# Altium project Module_Logic_MCU_ATtiny3224.PrjPcb
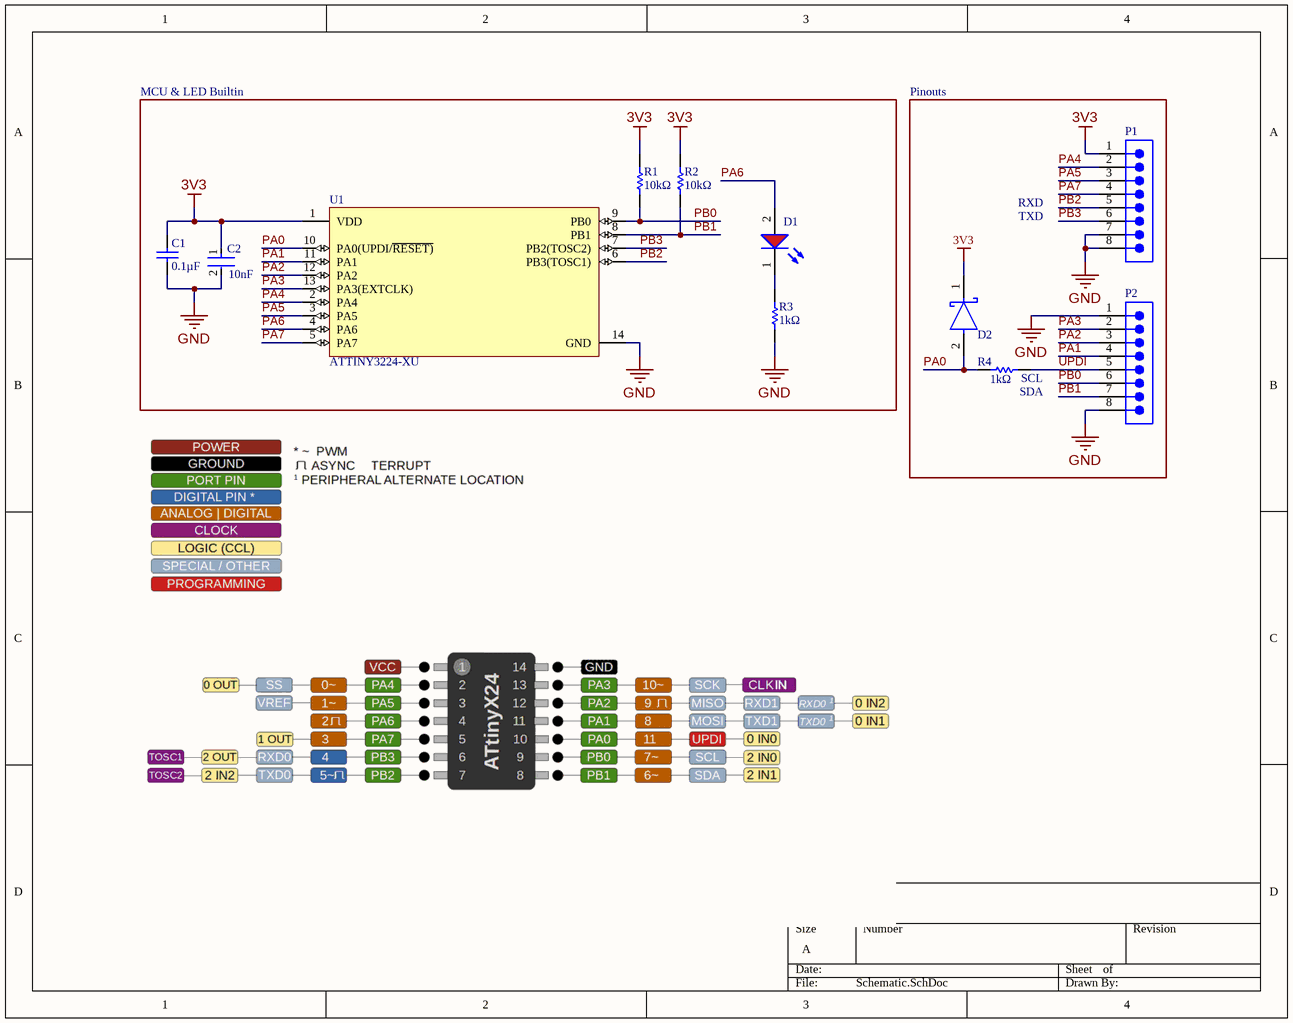
[diagram p0: Schematic.SchDoc]
1 sheet, 11 parts. Net scope: global (net labels, ports and power ports of the same name join across sheets).
Board file: PCB.PcbDoc

## Sheet Schematic.SchDoc
size A; SheetNumber: 1; SheetTotal: 1

### Parts
C1  0.1µF  [CAPC3216X100X50LL20T25]
C2  10nF  [FP-C1206C-EB-MFG]
D1  150120RS75000  [WL-SMCW_1206_150120xx75000]  (value not drawn)
D2  SS14-E3/61T  [FP-95400-MFG]  (value not drawn)
P1  61300811121  [61300811121]  (value not drawn)
P2  61300811121  [61300811121]  (value not drawn)
R1  10kΩ  [RESC3116X65X40LL10T20]
R2  10kΩ  [RESC3116X65X40LL10T20]
R3  1kΩ  [RESC3116X65X40LL10T20]
R4  1kΩ  [RESC3116X65X40LL10T20]
U1  ATTINY3224-XU  [FP-C04-087-ST-MFG]

### Blocks framed on the sheet
MCU & LED Builtin: C1 C2 D1 R1-R3 U1

### Nets
3V3: C1.2 C2.1 D2.1(C) P1.1 R1.2 R2.2 U1.1(VDD)
GND: C1.1 C2.2 P1.7 P1.8 P2.1 P2.8 R3.1 U1.14(GND)
PA0: D2.2(A) R4.1 U1.10(PA0(UPDI/~{RESET)})
PA1: P2.4 U1.11(PA1)
PA2: P2.3 U1.12(PA2)
PA3: P2.2 U1.13(PA3(EXTCLK))
PA4: P1.2 U1.2(PA4)
PA5: P1.3 U1.3(PA5)
PA6: D1.2(A) U1.4(PA6)
PA7: P1.4 U1.5(PA7)
PB0: P2.6 R1.1 U1.9(PB0)
PB1: P2.7 R2.1 U1.8(PB1)
PB2: P1.5 U1.6(PB3(TOSC1))
PB3: P1.6 U1.7(PB2(TOSC2))
UPDI: P2.5 R4.2
NetD1_1: D1.1(K) R3.2

### Notes on the sheet
- Pinouts
- RXD
- TXD
- (near R4) SCL
- (near R4) SDA

### Library data of the parts
C1 = CMP-1664-00001-4: Chip Capacitor, 100 nF, +/- 10%, 25 V, -55 to 125 degC, 1206 (3216 Metric), RoHS, Tape and Reel; Manufacturer: Kemet; Voltage Rating: 25 V; ComponentLink1URL: http://www.kemet.com/; Max Operating Temperature: 125 degC; PackageReference: 1206; ComponentLink2URL: http://www.kemet.com/docfinder?Partnumber=C1206F104K3RACTU; ComponentLink1Description: Manufacturer URL; ComponentLink2Description: Datasheet; Length: 3.2 mm; Packaging: Tape and Reel; Height: 0.78 mm; Mounting Technology: Surface Mount; REACH SVHC: No SVHC; PackageDescription: 2-Pin Surface Mount Device, Body 3.2 x 1.6 mm; Min Operating Temperature: -55 degC; RoHSCompliant: true; DatasheetVersion: 02/2016; Package Quantity: 4000
C2 = CMP-03020-003656-1: CAP CER 10000PF 100V X7R 1206; Manufacturer: KEMET; Manufacturer Part Number: C1206C103J1RACTU; Temperature Coefficient: 15%; Capacitance: 10,000 pF; Automotive Grade: Grade 0; Value: 10,000 pF; Material: Ceramic; Tolerance: 0.05; Digikey Description: CAP CER 10000PF 100V X7R 1206; Temperature Range Low: -55°C; Height: 0.88mm; Automotive: Yes; Ipc Land Pattern Name: CAPC320160X78; ComponentLink2URL: https://content.kemet.com/datasheets/KEM_C1007_X8R_ULTRA_150C_SMD.pdf; Device Class L2: Capacitors; Mouser Description: 1206 C 10nF Ceramic Multilayer Capacitor, 100 VDC, +125degC, X7R Dielec, +/-5%; Octopart: https://octopart.com/c1206c103j1ractu-kemet-121270; Category: Cap; Temperature Characteristic: X7R; Voltage Rating: 100 V; Temperature: -55°C to +150°C; Device Class L1: Passive Components; RoHS: TRUE; Device Class L3: Ceramic Capacitors; Package: C1206C-EB; Lead Free: Yes; ComponentLink2Description: Datasheet; Temperature Range High: +150°C
D1 = CMP-1426-00013-4: WL-SMCW SMT Mono-Color Chip LED Waterclear; Luminous Intensity: 150mcd; Max Junction Temperature (Tj): 95°C; Lens Style: Clear, Rectangular; Color: Red; Wavelength: 625nm; Forward Current: 100mA; Test Current: 20mA; Power Dissipation: 72mW; Forward Voltage: 2V; Peak Wavelength: 630nm; Reverse Voltage: 5V; Viewing Angle: 140°; Length: 3.2mm; Case Code (Imperial): 1206; Mount: Surface Mount; Case/Package: 1206; Packaging: Tape and Reel; REACH SVHC: Unknown; Max Operating Temperature: 85°C; RoHS: Compliant; Height: 680µm; Dominant Wavelength: 625nm; Width: 1.6mm; Max Reverse Voltage (DC): 5V; Case Code (Metric): 3216; Min Operating Temperature: -40°C
D2 = CMP-02539-000035-1: DIODE SCHOTTKY 40V 1A DO214AC; Manufacturer: Vishay; Peak Reverse Current: 0.2mA; Standoff Height: 0mm; Max Junction Temp: +150°C; Max Surge Forward Current: 40A; RoHS: TRUE; Digikey Description: DIODE SCHOTTKY 40V 1A DO214AC; Category: Diode; Device Class L3: Schottky Diodes; Temperature Range High: +150°C; Automotive: No; Temperature: -65°C to +150°C; Device Class L2: Diodes; Forward Current: 1A; Temperature Range Low: -65°C; Footprint Url: http://www.vishay.com/docs/95400/sma.pdf; Octopart: https://octopart.com/ss14-e3%2F61t-vishay-39552847; Package: 95400; Max Repetitive Reverse Voltage: 40V; ComponentLink2Description: Datasheet; ComponentLink2URL: http://www.vishay.com/docs/88746/ss12.pdf; Lead Free: Yes; Height: 2.29mm; Mouser Description: SS14 Series 40 V 1 A Surface Mount Schottky Barrier Rectifier - DO-214AC (SMA); Manufacturer Part Number: SS14-E3/61T; Device Class L1: Discrete Semiconductors
P1 P2 = CMP-1502-01076-3: NexarPartId: 32855533; Connector Type: Male Pin; Number of Contacts: 8; Voltage Rating: 250V; Current Rating: 3A; Contact Resistance: 20mΩ; Pitch: 2.54mm; Gender: Male; Termination: Solder; Contact Material: Copper; Mount: Through Hole; Lead Pitch: 2.54mm; Number of Positions: 8; Operating Supply Voltage: 250V; Number of Pins: 8; Max Operating Temperature: 105°C; Height: 8.54mm; REACH SVHC: Unknown; Number of Rows: 1; Packaging: Bulk; Contact Plating: Gold; Contact Mating Length: 5.9944mm; Orientation: Vertical; RoHS: Compliant; Color: Black; Min Operating Temperature: -40°C
R1 R2 = CMP-1014-00623-2: Chip Resistor, 10 KOhm, +/- 1%, 0.25 W, -55 to 155 degC, 1206 (3216 Metric), RoHS, Tape and Reel; Manufacturer: Yageo; Voltage Rating: 200V; Resistance: 10KOhm; Temperature Coefficient: 100ppm/degreesC; Power Rating: 250mW; Packaging: TapeandReel; Termination: SMD/SMT; REACH SVHC: Unknown; Tolerance: 1%; Height: 0.55mm; Composition: ThickFilm; Max Operating Temperature: 155degC; Datasheet Version: Rev. 5, 10/2016; Lead Free: LeadFree; Case Code (Metric): 3216; Depth: 1.6mm; Package Quantity: 5000; RoHSCompliant: true; Military Standard: Not; Case/Package: 1206; Case Code (Imperial): 1206; Min Operating Temperature: -55degC; Datasheet URL: http://www.yageo.com/NewPortal/yageodocoutput?fileName=/pdf/R-Chip/PYu-RC_Group_51_RoHS_L_5.pdf; Length: 3.1mm; Manufacturer URL: http://www.yageo.com/; Package Reference: 1206.0; Width: 1.6mm; Package Description: 2-Pin Surface Mount Device, Body 3.1 x 1.6 mm
R3 R4 = CMP-2100-03678-1: Chip Resistor, 1 KOhm, +/- 1%, 0.25 W, -55 to 155 degC, 1206 (3216 Metric), RoHS, Tape and Reel; Manufacturer: Yageo; Temperature Coefficient: 100ppm/degreesC; Power Rating: 250mW; Voltage Rating: 200V; Resistance: 1KOhm; Composition: ThickFilm; Min Operating Temperature: -55degC; Tolerance: 1%; REACH SVHC: Unknown; Case Code (Metric): 3216; Military Standard: Not; Datasheet Version: Rev. 5, 10/2016; Package Reference: 1206.0; Case/Package: 1206; Length: 3.1mm; Manufacturer URL: http://www.yageo.com/; Lead Free: LeadFree; RoHSCompliant: true; Termination: SMD/SMT; Packaging: TapeandReel; Package Description: 2-Pin Surface Mount Device, Body 3.1 x 1.6 mm; Depth: 1.6mm; Case Code (Imperial): 1206; Max Operating Temperature: 155degC; Datasheet URL: http://www.yageo.com/NewPortal/yageodocoutput?fileName=/pdf/R-Chip/PYu-RC_Group_51_RoHS_L_5.pdf; Height: 0.55mm
U1 = CMP-00252-122240563-1: ATTINY3224-XU Microcontroller 8-Bit AVR RISC 32KB Flash 1.8V to 5.5V 14-Pin TSSOP Tube; NexarPartId: 122240563